# Altium schematic sheet RS232.SchDoc
size A4
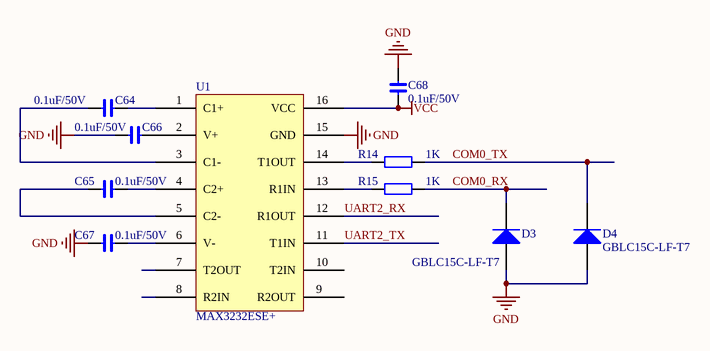
[diagram p0: RS232.SchDoc]

## Parts
C64  0.1uF/50V  [0402C]
C65  0.1uF/50V  [0402C]
C66  0.1uF/50V  [0402C]
C67  0.1uF/50V  [0402C]
C68  0.1uF/50V  [0402C]
D3  GBLC15C-LF-T7  [SOD323]
D4  GBLC15C-LF-T7  [SOD323]
R14  1K  [0402R]
R15  1K  [0402R]
U1  MAX3232ESE+  [SOIC127P600X265-16N]

## Nets
GND: C66.2 C67.2 C68.1 D3.A D4.A U1.15(GND)
VCC: C68.2 U1.16(VCC)
COM0_RX: D3.K R15.1
COM0_TX: D4.K R14.1
UART2_RX: U1.12(R1OUT)
UART2_TX: U1.11(T1IN)
NetC64_1: C64.1 U1.1(C1+)
NetC64_2: C64.2 U1.3(C1-)
NetC65_1: C65.1 U1.4(C2+)
NetC65_2: C65.2 U1.5(C2-)
NetC66_1: C66.1 U1.2(V+)
NetC67_1: C67.1 U1.6(V-)
NetR14_2: R14.2 U1.14(T1OUT)
NetR15_2: R15.2 U1.13(R1IN)

Not connected (* = marked no-connect by the designer): U1 7(T2OUT) 8(R2IN) 9(R2OUT) 10(T2IN)

## Library data of the parts
C64 C65 C67 = C
C66 C68 = C: Value: 0.1uF
D3 D4 = Diode: Default Diode; Published: 8-Jun-2000; LatestRevisionDate: 17-Jul-2002; LatestRevisionNote: Re-released for DXP Platform.; PackageVersion: Sep-1996; PackageReference: SMC; Publisher: Altium Limited; Code_JEDEC: DO-214-AB
R14 R15 = Res2: Resistor; Value: 22R; Published: 8-Jun-2000; LatestRevisionDate: 17-Jul-2002; LatestRevisionNote: Re-released for DXP Platform.; PackageReference: AXIAL-0.4; Publisher: Altium Limited